# EAGLE schematic PMB_LED (EAGLE 9.2.2)
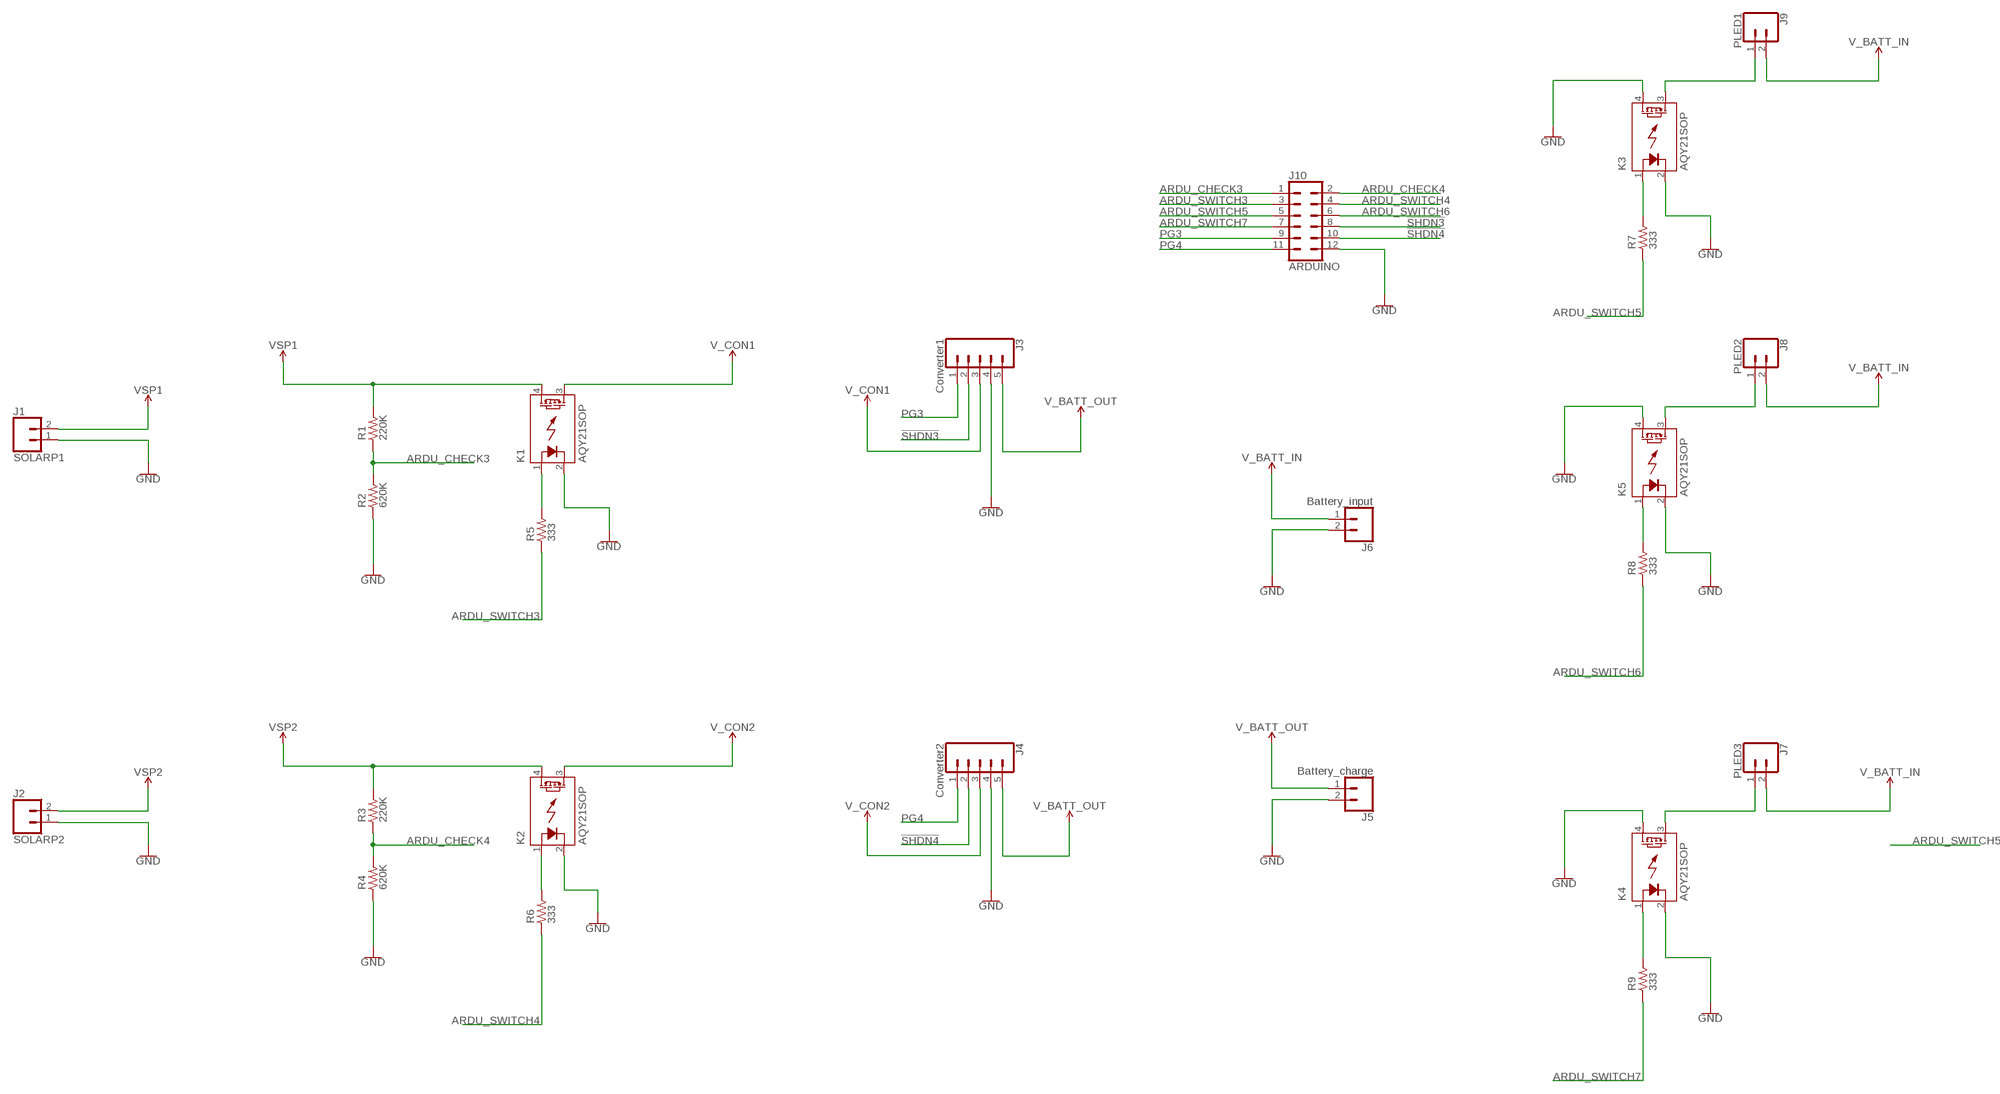
[diagram p0: schematic, sheet 1]

## Parts
J1  SOLARP1  CONN_02PTH3  [1X02_LONGPADS]
J2  SOLARP2  CONN_02PTH3  [1X02_LONGPADS]
J3  Converter1  CONN_05PTH_LONGPADS  [1X05_LONGPADS]
J4  Converter2  CONN_05PTH_LONGPADS  [1X05_LONGPADS]
J5  Battery_charge  CONN_02LOCK_LONGPADS  [1X02_LOCK_LONGPADS]
J6  Battery_input  CONN_02LOCK_LONGPADS  [1X02_LOCK_LONGPADS]
J7  PLED3  CONN_02  [1X02]
J8  PLED2  CONN_02  [1X02]
J9  PLED1  CONN_02  [1X02]
J10  ARDUINO  CONN_06X2PTH_FEMALE  [2X6]
K1  AQY21SOP  [SOP04]
K2  AQY21SOP  [SOP04]
K3  AQY21SOP  [SOP04]
K4  AQY21SOP  [SOP04]
K5  AQY21SOP  [SOP04]
R1  220K  R_1206  [R1206]
R2  620K  R_1206  [R1206]
R3  220K  R_1206  [R1206]
R4  620K  R_1206  [R1206]
R5  333  R_1206  [R1206]
R6  333  R_1206  [R1206]
R7  333  R_1206  [R1206]
R8  333  R_1206  [R1206]
R9  333  R_1206  [R1206]

## Nets
!SHDN3: J3.2 J10.8
!SHDN4: J4.2 J10.10
ARDU_CHECK3: J10.1 R1.1 R2.2
ARDU_CHECK4: J10.2 R3.1 R4.2
ARDU_SWITCH3: J10.3 R5.1
ARDU_SWITCH4: J10.4 R6.1
ARDU_SWITCH5: J10.5 R7.1
ARDU_SWITCH6: J10.6 R8.1
ARDU_SWITCH7: J10.7 R9.1
GND: J1.1 J2.1 J3.4 J4.4 J5.2 J6.2 J10.12 K1.2(K) K2.2(K) K3.2(K) K3.4(DS1) K4.2(K) K4.4(DS1) K5.2(K) K5.4(DS1) R2.1 R4.1
N$1: J8.1 K5.3(DS2)
N$2: J9.1 K3.3(DS2)
N$3: J7.1 K4.3(DS2)
N$4: K2.1(A) R6.2
N$5: K1.1(A) R5.2
N$6: K3.1(A) R7.2
N$7: K5.1(A) R8.2
N$8: K4.1(A) R9.2
PG3: J3.1 J10.9
PG4: J4.1 J10.11
V_BATT: J3.5 J4.5 J5.1 ; supply symbol labelled V_BATT_OUT
VCC: J2.2 K2.4(DS1) R3.2 ; supply symbol labelled VSP2
VCC_1: J1.2 K1.4(DS1) R1.2 ; supply symbol labelled VSP1
VCC_2: J3.3 K1.3(DS2) ; supply symbol labelled V_CON1
VDD: J6.1 J7.2 J8.2 J9.2 ; supply symbol labelled V_BATT_IN
VIN: J4.3 K2.3(DS2) ; supply symbol labelled V_CON2

## Library data of the parts
J1 J2 J5-J9 = SparkFun-Connectors:CONN_02: Multi connection point. Often used as Generic Header-pin footprint for 0.1 inch spaced/style header connections On any of the 0.1 inch spaced packages, you can populate with these: Break Away Headers - Straight <https://www.sparkfun.com/products/116> (PRT-00116) Break Away Male Headers - Right Angle <https://www.sparkfun.com/products/553> (PRT-00553) Female Headers <https://www.sparkfun.com/products/115> (PRT-00115) Break Away Headers - Machine Pin <https://www.sparkfun.com/products/117> (PRT-00117) Break Away Female Headers - Swiss Machine Pin <https://www.sparkfun.com/products/743> (PRT-00743) For SCREWTERMINALS and SPRING TERMINALS visit here: Screw Terimnals on SparkFun.com <https://www.sparkfun.com/search/results?term=Screw+Terminals> (5mm/3.5mm/2.54mm spacing) This device is also useful as a general connection point to wire up your design to another part of your project. Our various solder wires solder well into these plated through hole pads. Hook-Up Wire - Assortment (Stranded, 22 AWG) <https://www.sparkfun.com/products/11375> (PRT-11375) Hook-Up Wire - Assortment (Solid Core, 22 AWG) <https://www.sparkfun.com/products/11367> (PRT-11367) View the entire wire category on our website here <https://www.sparkfun.com/categories/141> Special notes: Molex polarized connector foot print use with: PRT-08233 with associated crimp pins and housings. 2.54_SCREWTERM for use with PRT-10571. 3.5mm Screw Terminal footprints for PRT-08084 5mm Screw Terminal footprints for use with PRT-08432
J3 J4 = SparkFun-Connectors:CONN_05: Multi connection point. Often used as Generic Header-pin footprint for 0.1 inch spaced/style header connections On any of the 0.1 inch spaced packages, you can populate with these: Break Away Headers - Straight <https://www.sparkfun.com/products/116> (PRT-00116) Break Away Male Headers - Right Angle <https://www.sparkfun.com/products/553> (PRT-00553) Female Headers <https://www.sparkfun.com/products/115> (PRT-00115) Break Away Headers - Machine Pin <https://www.sparkfun.com/products/117> (PRT-00117) Break Away Female Headers - Swiss Machine Pin <https://www.sparkfun.com/products/743> (PRT-00743) For SCREWTERMINALS and SPRING TERMINALS visit here: Screw Terimnals on SparkFun.com <https://www.sparkfun.com/search/results?term=Screw+Terminals> (5mm/3.5mm/2.54mm spacing) This device is also useful as a general connection point to wire up your design to another part of your project. Our various solder wires solder well into these plated through hole pads. Hook-Up Wire - Assortment (Stranded, 22 AWG) <https://www.sparkfun.com/products/11375> (PRT-11375) Hook-Up Wire - Assortment (Solid Core, 22 AWG) <https://www.sparkfun.com/products/11367> (PRT-11367) View the entire wire category on our website here <https://www.sparkfun.com/categories/141> Special notes: Molex polarized connector foot print use with SKU : PRT-08231 with associated crimp pins and housings. 1MM SMD Version SKU: PRT-10208
J10 = SparkFun-Connectors:CONN_06X2: Multi connection point. Often used as Generic Header-pin footprint for 0.1 inch spaced/style header connections On any of the 0.1 inch spaced packages, you can populate with these: Break Away Headers - Straight <https://www.sparkfun.com/products/116> (PRT-00116) Break Away Male Headers - Right Angle <https://www.sparkfun.com/products/553> (PRT-00553) Female Headers <https://www.sparkfun.com/products/115> (PRT-00115) Break Away Headers - Machine Pin <https://www.sparkfun.com/products/117> (PRT-00117) Break Away Female Headers - Swiss Machine Pin <https://www.sparkfun.com/products/743> (PRT-00743); PROD_ID: CONN-12423; VALUE: 2X6 FEMALE
K1-K5 = relay:AQY*: PhotoMOS Relay NAiS Source: http://www.panasonic-electric-works.com/catalogues/downloads/photomos/ds_x615_en_aqz10_20.pdf; OC_FARNELL: unknown; OC_NEWARK: unknown
R1-R9 = rc-master-smd:R_: RESISTOR